# EAGLE schematic main_board (EAGLE 6.2)
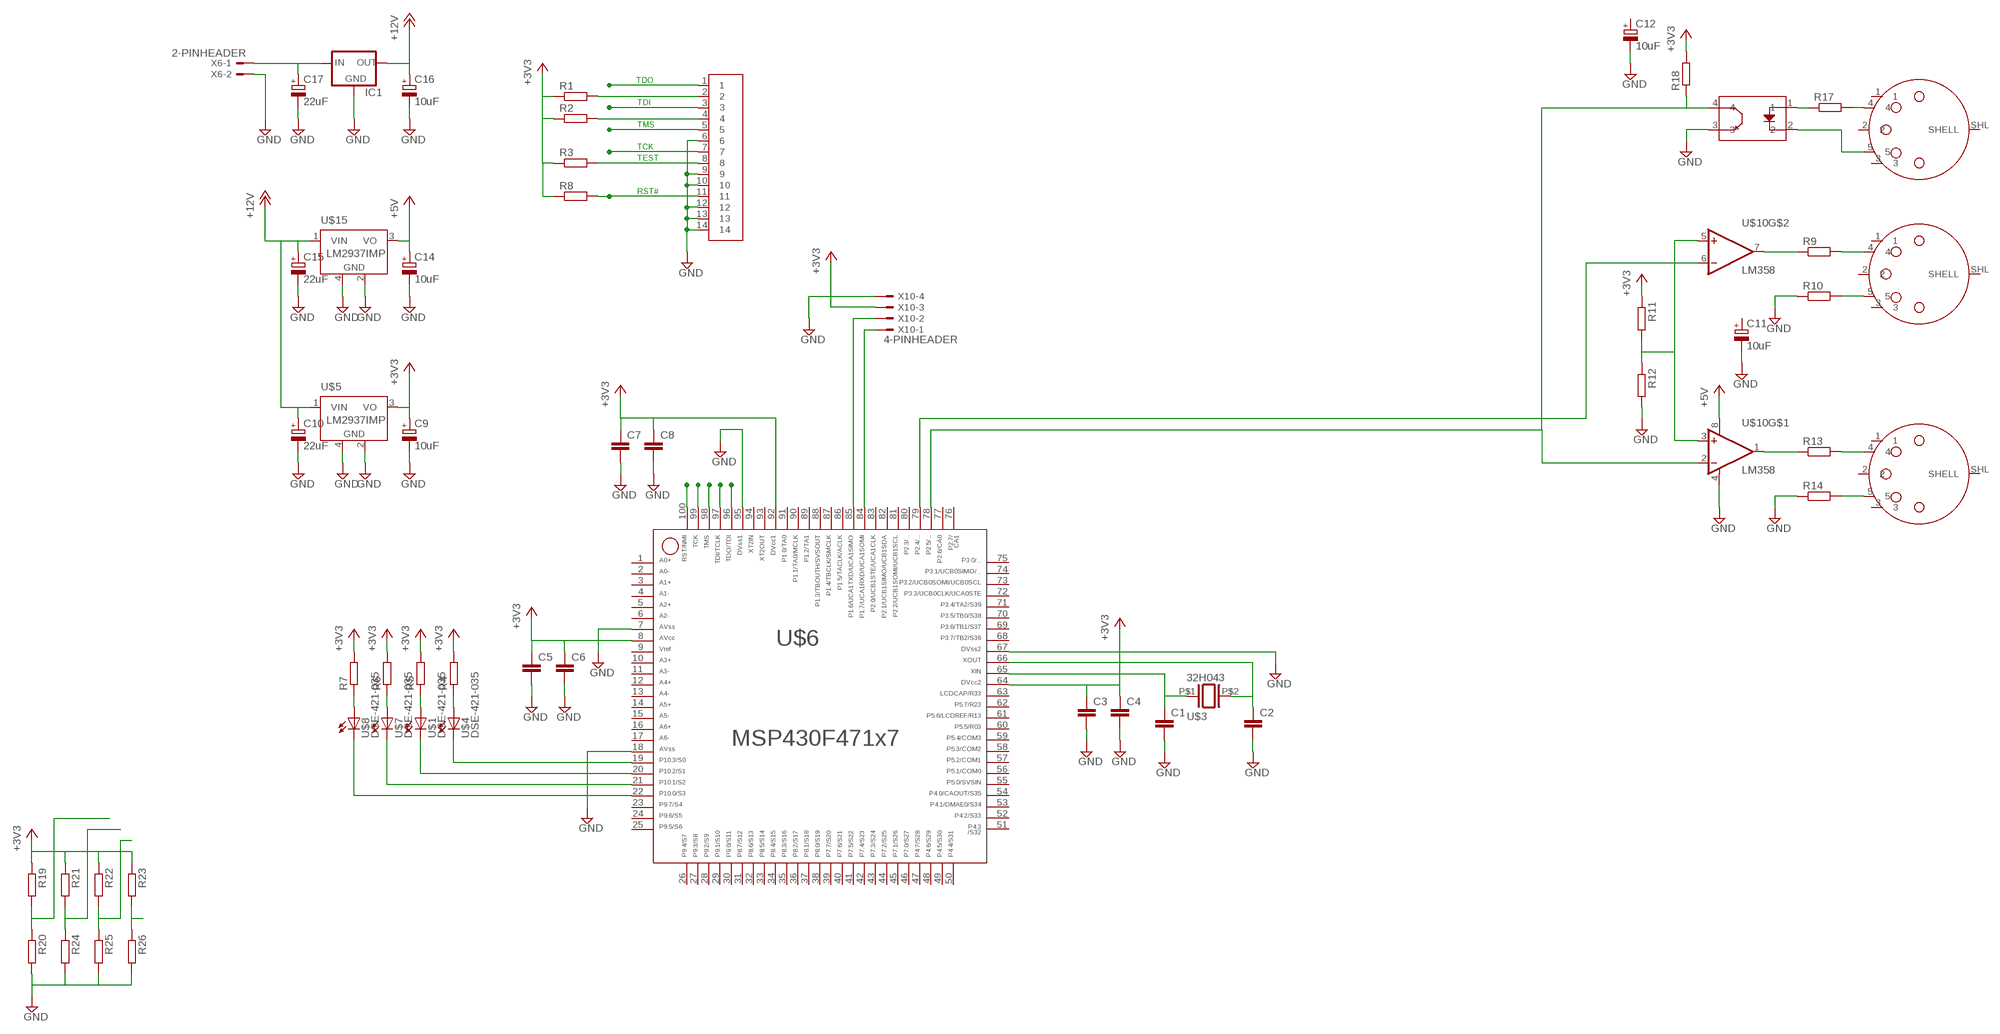
[diagram p0: schematic, sheet 1]

## Parts
C1  C-EUC0402  [C0402]
C2  C-EUC0402  [C0402]
C3  C-EUC0402  [C0402]
C4  C-EUC0402  [C0402]
C5  C-EUC0402  [C0402]
C6  C-EUC0402  [C0402]
C7  C-EUC0402  [C0402]
C8  C-EUC0402  [C0402]
C9  10uF  CPOL-EUSMCC  [SMC_C]
C10  22uF  CPOL-EUSMCD  [SMC_D]
C11  10uF  CPOL-EUSMCC  [SMC_C]
C12  10uF  CPOL-EUSMCC  [SMC_C]
C14  10uF  CPOL-EUSMCC  [SMC_C]
C15  22uF  CPOL-EUSMCD  [SMC_D]
C16  10uF  CPOL-EUSMCC  [SMC_C]
C17  22uF  CPOL-EUSMCD  [SMC_D]
IC1  78MXXS  [78MXXS]
R1  R-EU_R0402  [R0402]
R2  R-EU_R0402  [R0402]
R3  R-EU_R0402  [R0402]
R4  R-EU_R0402  [R0402]
R5  R-EU_R0402  [R0402]
R6  R-EU_R0402  [R0402]
R7  R-EU_R0402  [R0402]
R8  R-EU_R0402  [R0402]
R9  R-EU_R1206  [R1206]
R10  R-EU_R1206  [R1206]
R11  R-EU_R0402  [R0402]
R12  R-EU_R0402  [R0402]
R13  R-EU_R1206  [R1206]
R14  R-EU_R1206  [R1206]
R17  R-EU_R1206  [R1206]
R18  R-EU_R1206  [R1206]
R19  R-EU_R0402  [R0402]
R20  R-EU_R0402  [R0402]
R21  R-EU_R0402  [R0402]
R22  R-EU_R0402  [R0402]
R23  R-EU_R0402  [R0402]
R24  R-EU_R0402  [R0402]
R25  R-EU_R0402  [R0402]
R26  R-EU_R0402  [R0402]
U$1  DSE-421-035  [2432]
U$2  2X7SMD_HEADER  [2X14SMDPADS]
U$3  32H043  [XTAL-SMALL-4]
U$4  DSE-421-035  [2432]
U$5  LM2937IMP  [SOT223]
U$6  F471X7---PZ100  [PZ100]
U$7  DSE-421-035  [2432]
U$8  DSE-421-035  [2432]
U$9  MIDI_VERT  [DIN-5_VERT]
U$10  LM358  [SO08]
U$11  MIDI_VERT  [DIN-5_VERT]
U$15  LM2937IMP  [SOT223]
U$19  F2801A  [LONG_TSOP]
U$20  MIDI_VERT  [DIN-5_VERT]
X6  2-PINHEADER  [22-23-2021]
X10  4-PINHEADER  [22-23-2041]

## Nets
+3V3: C3.1 C4.1 C5.1 C6.1 C7.1 C8.1 C9.+ R1.1 R2.1 R3.1 R4.2 R5.2 R6.2 R7.2 R8.1 R11.1 R18.2 R19.1 R21.1 R22.1 R23.1 U$5.3(VO) U$6.8 U$6.64 U$6.92 X10.3
+5V: C14.+ U$10.8(V+) U$15.3(VO)
+12V: C10.+ C15.+ C16.+ IC1.OUT U$5.1(VIN) U$15.1(VIN)
GND: C1.2 C2.2 C3.2 C4.2 C5.2 C6.2 C7.2 C8.2 C9.- C10.- C11.- C12.- C14.- C15.- C16.- C17.- IC1.GND R10.1 R12.2 R14.1 R20.2 R24.2 R25.2 R26.2 U$2.6 U$2.9 U$2.10 U$2.12 U$2.13 U$2.14 U$5.2(GND) U$5.4(GND) U$6.7 U$6.18 U$6.67 U$6.95 U$10.4(V-) U$15.2(GND) U$15.4(GND) U$19.3 X6.2 X10.4
N$1: R1.2 U$2.2
N$2: C1.1 U$3.P$1 U$6.65
N$3: C2.1 U$3.P$2 U$6.66
N$4: R2.2 U$2.4
N$5: U$6.22 U$8.MARKED(C)
N$6: U$6.21 U$7.MARKED(C)
N$7: U$1.MARKED(C) U$6.20
N$8: U$4.MARKED(C) U$6.19
N$9: R7.1 U$8.P$1(A)
N$10: R6.1 U$7.P$1(A)
N$11: R5.1 U$1.P$1(A)
N$12: R4.1 U$4.P$1(A)
N$13: U$6.84 X10.1
N$14: R10.2 U$9.5
N$15: R9.2 U$9.4
N$16: R9.1 U$10.7(OUT)
N$17: U$6.79 U$10.6(-IN)
N$18: R11.2 R12.1 U$10.3(+IN) U$10.5(+IN)
N$20: R14.2 U$11.5
N$21: R13.2 U$11.4
N$22: R13.1 U$10.1(OUT)
N$32: U$6.85 X10.2
N$36: R17.2 U$20.4
N$39: R17.1 U$19.1
N$40: U$19.2 U$20.5
N$41: R18.1 U$6.78 U$10.2(-IN) U$19.4
N$42: C17.+ IC1.IN X6.1
N$43: R19.2 R20.1
N$44: R21.2 R24.1
N$45: R22.2 R25.1
N$46: R23.2 R26.1
RST#: R8.2 U$2.11 U$6.100
TCK: U$2.7 U$6.99
TDI: U$2.3 U$6.97
TDO: U$2.1 U$6.96
TEST: R3.2 U$2.8
TMS: U$2.5 U$6.98
Unconnected: C11.+ C12.+ U$6.1 U$6.2 U$6.3 U$6.4 U$6.5 U$6.6 U$6.9 U$6.10 U$6.11 U$6.12 U$6.13 U$6.14 U$6.15 U$6.16 U$6.17 U$6.23 U$6.24 U$6.25 U$6.26 U$6.27 U$6.28 U$6.29 U$6.30 U$6.31 U$6.32 U$6.33 U$6.34 U$6.35 U$6.36 U$6.37 U$6.38 U$6.39 U$6.40 U$6.41 U$6.42 U$6.43 U$6.44 U$6.45 U$6.46 U$6.47 U$6.48 U$6.49 U$6.50 U$6.51 U$6.52 U$6.53 U$6.54 U$6.55 U$6.56 U$6.57 U$6.58 U$6.59 U$6.60 U$6.61 U$6.62 U$6.63 U$6.68 U$6.69 U$6.70 U$6.71 U$6.72 U$6.73 U$6.74 U$6.75 U$6.76 U$6.77 U$6.80 U$6.81 U$6.82 U$6.83 U$6.86 U$6.87 U$6.88 U$6.89 U$6.90 U$6.91 U$6.93 U$6.94 U$9.1 U$9.2 U$9.3 U$9.SHL(SHELL) U$11.1 U$11.2 U$11.3 U$11.SHL(SHELL) U$20.1 U$20.2 U$20.3 U$20.SHL(SHELL)

## Notes on the sheet
- TDO
- TDI
- TMS
- TCK
- TEST
- RST#

## Library data of the parts
C1-C8 = rcl:C-EU: CAPACITOR, European symbol
C9-C12 C14-C17 = rcl:CPOL-EU: POLARIZED CAPACITOR, European symbol
IC1 = v-reg:78MXXS: VOLTAGE REGULATOR
R1-R14 R17-R26 = rcl:R-EU_: RESISTOR, European symbol
U$1 U$4 U$7 U$8 = synth_design:DSE-421-035
U$2 = synth_design:2X7SMD_HEADER
U$3 = synth_design:32H043
U$5 U$15 = synth_design:LM2937IMP
U$6 = TI_MSP430_v16:F471X7---PZ100: ***MSP430F471x7***PZ100
U$9 U$11 U$20 = synth_design:MIDI_VERT
U$10 = synth_design:LM358
U$19 = synth_design:F2801A
X6 = Custom_headers:2-PINHEADER: .100" (2.54mm) Center Header - 2 Pin; MF: MOLEX; MPN: 22-23-2021; OC_FARNELL: 1462926; OC_NEWARK: 25C3832
X10 = Custom_headers:4-PINHEADER: .100" (2.54mm) Center Header - 4 Pin; MF: MOLEX; MPN: 22-23-2041; OC_FARNELL: 1462920; OC_NEWARK: 38C0355